# Altium schematic sheet Logic_Converter.SchDoc
size A4; SheetNumber: 4; SheetTotal: 4
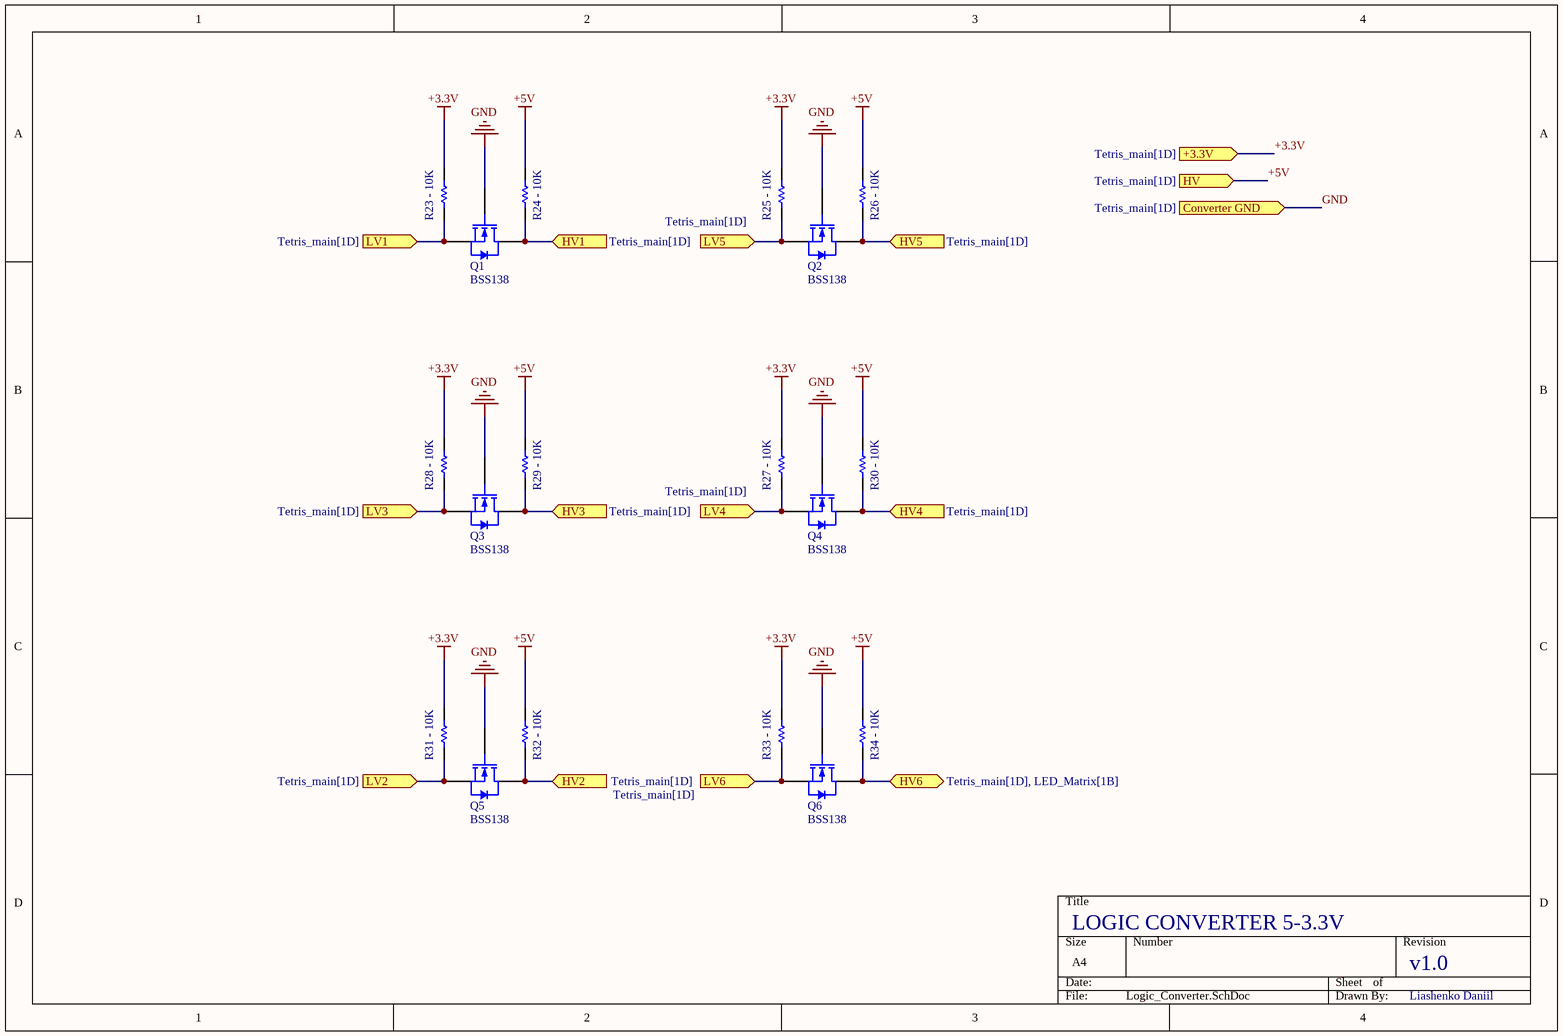
[diagram p0: Logic_Converter.SchDoc]

## Parts
Q1  BSS138  [FAIR-SOT23-3_V]
Q2  BSS138  [FAIR-SOT23-3_V]
Q3  BSS138  [FAIR-SOT23-3_V]
Q4  BSS138  [FAIR-SOT23-3_V]
Q5  BSS138  [FAIR-SOT23-3_V]
Q6  BSS138  [FAIR-SOT23-3_V]
R23_-_10K  RC0603JR-074K7L  [RESC1608X55X25ML10T15]  (value not drawn)
R24_-_10K  RC0603JR-074K7L  [RESC1608X55X25ML10T15]  (value not drawn)
R25_-_10K  RC0603JR-074K7L  [RESC1608X55X25ML10T15]  (value not drawn)
R26_-_10K  RC0603JR-074K7L  [RESC1608X55X25ML10T15]  (value not drawn)
R27_-_10K  RC0603JR-074K7L  [RESC1608X55X25ML10T15]  (value not drawn)
R28_-_10K  RC0603JR-074K7L  [RESC1608X55X25ML10T15]  (value not drawn)
R29_-_10K  RC0603JR-074K7L  [RESC1608X55X25ML10T15]  (value not drawn)
R30_-_10K  RC0603JR-074K7L  [RESC1608X55X25ML10T15]  (value not drawn)
R31_-_10K  RC0603JR-074K7L  [RESC1608X55X25ML10T15]  (value not drawn)
R32_-_10K  RC0603JR-074K7L  [RESC1608X55X25ML10T15]  (value not drawn)
R33_-_10K  RC0603JR-074K7L  [RESC1608X55X25ML10T15]  (value not drawn)
R34_-_10K  RC0603JR-074K7L  [RESC1608X55X25ML10T15]  (value not drawn)

## Ports
+3.3V (in, see Tetris_main[1D]), Converter GND (in, see Tetris_main[1D]), HV1 (in, see Tetris_main[1D]), HV2 (in, see Tetris_main[1D]), HV3 (in, see Tetris_main[1D]), HV4 (in, see Tetris_main[1D]), HV5 (in, see Tetris_main[1D]), HV6 (bidir, see Tetris_main[1D], LED_Matrix[1B]), HV (in, see Tetris_main[1D]), LV1 (in, see Tetris_main[1D]), LV2 (in, see Tetris_main[1D]), LV3 (in, see Tetris_main[1D]), LV4 (in, see Tetris_main[1D]), LV5 (in, see Tetris_main[1D]), LV6 (in, see Tetris_main[1D])

## Nets
+3.3V: R23_-_10K.2 R25_-_10K.2 R27_-_10K.2 R28_-_10K.2 R31_-_10K.2 R33_-_10K.2 ; port +3.3V
+5V: R24_-_10K.2 R26_-_10K.2 R29_-_10K.2 R30_-_10K.2 R32_-_10K.2 R34_-_10K.2 ; port HV
GND: Q1.1(G) Q2.1(G) Q3.1(G) Q4.1(G) Q5.1(G) Q6.1(G) ; port Converter GND
HV1: Q1.3(D) R24_-_10K.1 ; port HV1
HV2: Q5.3(D) R32_-_10K.1 ; port HV2
HV3: Q3.3(D) R29_-_10K.1 ; port HV3
HV4: Q4.3(D) R30_-_10K.1 ; port HV4
HV5: Q2.3(D) R26_-_10K.1 ; port HV5
HV6: Q6.3(D) R34_-_10K.1 ; port HV6
LV1: Q1.2(S) R23_-_10K.1 ; port LV1
LV2: Q5.2(S) R31_-_10K.1 ; port LV2
LV3: Q3.2(S) R28_-_10K.1 ; port LV3
LV4: Q4.2(S) R27_-_10K.1 ; port LV4
LV5: Q2.2(S) R25_-_10K.1 ; port LV5
LV6: Q6.2(S) R33_-_10K.1 ; port LV6

## Notes on the sheet
- LOGIC CONVERTER 5-3.3V
- v1.0
- Liashenko Daniil

## Library data of the parts
Q1-Q6 = CMP-013-00021-4: N-Channel Logic Level Enhancement Mode Field Effect Transistor, 220 mA, 50 V, -55 to 150 degC, 3-Pin SOT-23, RoHS, Tape and Reel; Manufacturer: Fairchild; Elements: 1; Nominal Vgs: 1.3V; Resistance: 0.7Ohm; Typical Rise Time: 9ns; Rds On Max: 3.5Ohm; Nominal Dual Supply Voltage: 50V; Input Capacitance: 27pF; Package Version: Rev. 12, 03/2016; Power: 360mW; Packaging: TapeandReel; Package Description: 3-Pin Small Outline Transistor, Body 2.92 x 1.325 mm, Pitch 0.95 mm; Datasheet URL: https://www.fairchildsemi.com/datasheets/BS/BSS138.pdf; Min Operating Temperature: -55°C; Pins: 3; RoHS Compliant: True; Package Reference: SOT23-3; Package Quantity: 1; Case/Package: TO-236-3; Mounting Technology: SM; Max Operating Temperature: 150°C; Datasheet Version: Rev. C, 10/2005
R23_-_10K R24_-_10K R25_-_10K R26_-_10K R27_-_10K R28_-_10K R29_-_10K R30_-_10K R31_-_10K R32_-_10K R33_-_10K R34_-_10K = CMP-2000-05024-1: Chip Resistor, 4.7 KOhm, +/- 5%, 100 mW, -55 to 155 degC, 0603 (1608 Metric), RoHS, Tape and Reel; Manufacturer: Yageo; Resistance: 4.7kOhms; Temperature Coefficient: 100PPM/C; Power Rating: 100mW; Voltage Rating: 50V; Operating Temperature Range: -55Cto+155C; Case Code - mm: 1608; Tolerance: 5%; Product: ThickFilmResistorsGeneralPurpose; Case Code - in: 0603; Datasheet URL: http://www.yageo.com/documents/recent/PYu-RC_Group_51_RoHS_L_04.pdf; Package Reference: 603; Datasheet Version: Rev. 4, 02/2016; Package Description: 2-Pin Surface Mount Device, Body 1.6 x 0.8 mm; Manufacturer URL: http://www.yageo.com/; Series: RC; Packaging: Reel; Termination Style: SMD/SMT